# Altium schematic sheet EDU_High-Speed-Design_CPU_Unused.SchDoc: CPU Unused
size 431 x 279 mm; Date: not used; ApprovedBy: not used; CheckedBy: not used; Author: not used; DrawnBy: not used; Organization: not used; Address4: not used; SheetNumber: 27; SheetTotal: 27; Time: not used; ImagePath: not used; Application_BuildNumber: not used
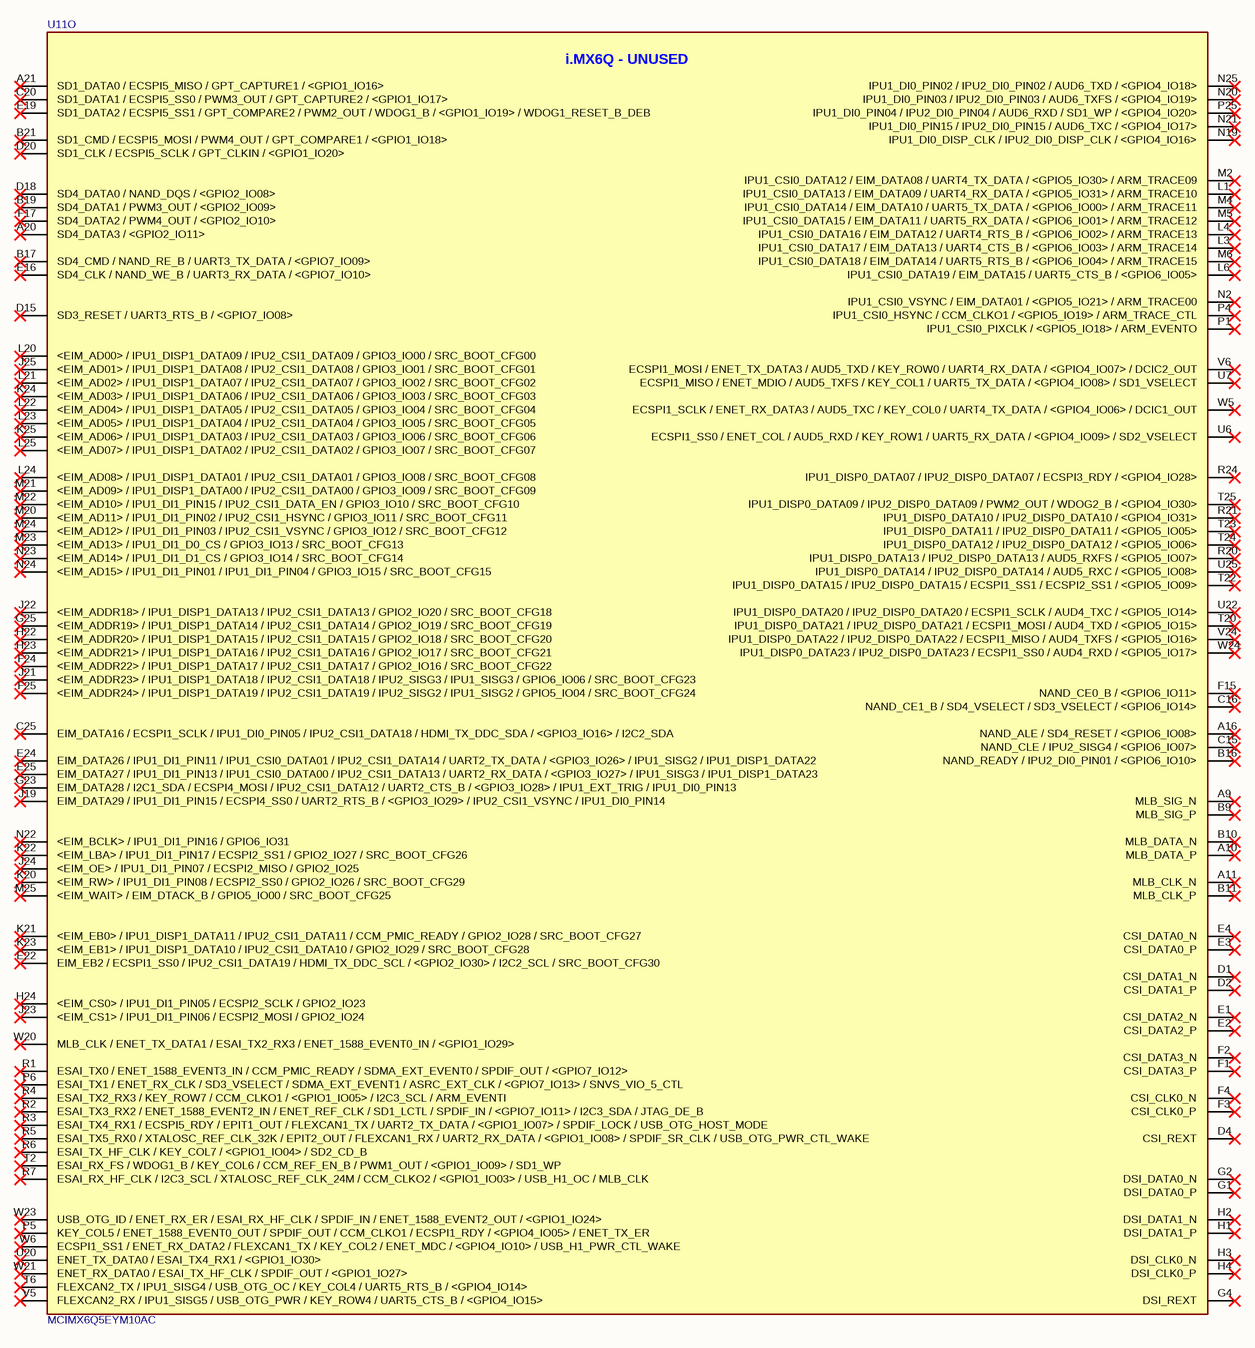
[diagram p0: EDU_High-Speed-Design_CPU_Unused.SchDoc]

## Parts
U11  MCIMX6Q5EYM10AC  [MCIMX6Q5EYM10AC]  (part O of 15)

## Nets

Not connected (* = marked no-connect by the designer): U11 A9(MLB_SIG_N)* A10(MLB_DATA_P)* A11(MLB_CLK_N)* A16(NAND_ALE_/_SD4_RESET_/_<GPIO6_IO08>)* A20(SD4_DATA3_/_<GPIO2_IO11>)* A21(SD1_DATA0_/_ECSPI5_MISO_/_GPT_CAPTURE1_/_<GPIO1_IO16>)* B9(MLB_SIG_P)* B10(MLB_DATA_N)* B11(MLB_CLK_P)* B16(NAND_READY_/_IPU2_DI0_PIN01_/_<GPIO6_IO10>)* B17(SD4_CMD_/_NAND_RE_B_/_UART3_TX_DATA_/_<GPIO7_IO09>)* B19(SD4_DATA1_/_PWM3_OUT_/_<GPIO2_IO09>)* B21(SD1_CMD_/_ECSPI5_MOSI_/_PWM4_OUT_/_GPT_COMPARE1_/_<GPIO1_IO18>)* C15(NAND_CLE_/_IPU2_SISG4_/_<GPIO6_IO07>)* C16(NAND_CE1_B_/_SD4_VSELECT_/_SD3_VSELECT_/_<GPIO6_IO14>)* C20(SD1_DATA1_/_ECSPI5_SS0_/_PWM3_OUT_/_GPT_CAPTURE2_/_<GPIO1_IO17>)* C25(EIM_DATA16_/_ECSPI1_SCLK_/_IPU1_DI0_PIN05_/_IPU2_CSI1_DATA18_/_HDMI_TX_DDC_SDA_/_<GPIO3_IO16>_/_I2C2_SDA)* D1(CSI_DATA1_N)* D2(CSI_DATA1_P)* D4(CSI_REXT)* D15(SD3_RESET_/_UART3_RTS_B_/_<GPIO7_IO08>)* D18(SD4_DATA0_/_NAND_DQS_/_<GPIO2_IO08>)* D20(SD1_CLK_/_ECSPI5_SCLK_/_GPT_CLKIN_/_<GPIO1_IO20>)* E1(CSI_DATA2_N)* E2(CSI_DATA2_P)* E3(CSI_DATA0_P)* E4(CSI_DATA0_N)* E16(SD4_CLK_/_NAND_WE_B_/_UART3_RX_DATA_/_<GPIO7_IO10>)* E19(SD1_DATA2_/_ECSPI5_SS1_/_GPT_COMPARE2_/_PWM2_OUT_/_WDOG1_B_/_<GPIO1_IO19>_/_WDOG1_RESET_B_DEB)* E22(EIM_EB2_/_ECSPI1_SS0_/_IPU2_CSI1_DATA19_/_HDMI_TX_DDC_SCL_/_<GPIO2_IO30>_/_I2C2_SCL_/_SRC_BOOT_CFG30)* E24(EIM_DATA26_/_IPU1_DI1_PIN11_/_IPU1_CSI0_DATA01_/_IPU2_CSI1_DATA14_/_UART2_TX_DATA_/_<GPIO3_IO26>_/_IPU1_SISG2_/_IPU1_DISP1_DATA22)* E25(EIM_DATA27_/_IPU1_DI1_PIN13_/_IPU1_CSI0_DATA00_/_IPU2_CSI1_DATA13_/_UART2_RX_DATA_/_<GPIO3_IO27>_/_IPU1_SISG3_/_IPU1_DISP1_DATA23)* F1(CSI_DATA3_P)* F2(CSI_DATA3_N)* F3(CSI_CLK0_P)* F4(CSI_CLK0_N)* F15(NAND_CE0_B_/_<GPIO6_IO11>)* F17(SD4_DATA2_/_PWM4_OUT_/_<GPIO2_IO10>)* F24(<EIM_ADDR22>_/_IPU1_DISP1_DATA17_/_IPU2_CSI1_DATA17_/_GPIO2_IO16_/_SRC_BOOT_CFG22)* F25(<EIM_ADDR24>_/_IPU1_DISP1_DATA19_/_IPU2_CSI1_DATA19_/_IPU2_SISG2_/_IPU1_SISG2_/_GPIO5_IO04_/_SRC_BOOT_CFG24)* G1(DSI_DATA0_P)* G2(DSI_DATA0_N)* G4(DSI_REXT)* G23(EIM_DATA28_/_I2C1_SDA_/_ECSPI4_MOSI_/_IPU2_CSI1_DATA12_/_UART2_CTS_B_/_<GPIO3_IO28>_/_IPU1_EXT_TRIG_/_IPU1_DI0_PIN13)* G25(<EIM_ADDR19>_/_IPU1_DISP1_DATA14_/_IPU2_CSI1_DATA14_/_GPIO2_IO19_/_SRC_BOOT_CFG19)* H1(DSI_DATA1_P)* H2(DSI_DATA1_N)* H3(DSI_CLK0_N)* H4(DSI_CLK0_P)* H22(<EIM_ADDR20>_/_IPU1_DISP1_DATA15_/_IPU2_CSI1_DATA15_/_GPIO2_IO18_/_SRC_BOOT_CFG20)* H23(<EIM_ADDR21>_/_IPU1_DISP1_DATA16_/_IPU2_CSI1_DATA16_/_GPIO2_IO17_/_SRC_BOOT_CFG21)* H24(<EIM_CS0>_/_IPU1_DI1_PIN05_/_ECSPI2_SCLK_/_GPIO2_IO23)* J19(EIM_DATA29_/_IPU1_DI1_PIN15_/_ECSPI4_SS0_/_UART2_RTS_B_/_<GPIO3_IO29>_/_IPU2_CSI1_VSYNC_/_IPU1_DI0_PIN14)* J21(<EIM_ADDR23>_/_IPU1_DISP1_DATA18_/_IPU2_CSI1_DATA18_/_IPU2_SISG3_/_IPU1_SISG3_/_GPIO6_IO06_/_SRC_BOOT_CFG23)* J22(<EIM_ADDR18>_/_IPU1_DISP1_DATA13_/_IPU2_CSI1_DATA13_/_GPIO2_IO20_/_SRC_BOOT_CFG18)* J23(<EIM_CS1>_/_IPU1_DI1_PIN06_/_ECSPI2_MOSI_/_GPIO2_IO24)* J24(<EIM_OE>_/_IPU1_DI1_PIN07_/_ECSPI2_MISO_/_GPIO2_IO25)* J25(<EIM_AD01>_/_IPU1_DISP1_DATA08_/_IPU2_CSI1_DATA08_/_GPIO3_IO01_/_SRC_BOOT_CFG01)* K20(<EIM_RW>_/_IPU1_DI1_PIN08_/_ECSPI2_SS0_/_GPIO2_IO26_/_SRC_BOOT_CFG29)* K21(<EIM_EB0>_/_IPU1_DISP1_DATA11_/_IPU2_CSI1_DATA11_/_CCM_PMIC_READY_/_GPIO2_IO28_/_SRC_BOOT_CFG27)* K22(<EIM_LBA>_/_IPU1_DI1_PIN17_/_ECSPI2_SS1_/_GPIO2_IO27_/_SRC_BOOT_CFG26)* K23(<EIM_EB1>_/_IPU1_DISP1_DATA10_/_IPU2_CSI1_DATA10_/_GPIO2_IO29_/_SRC_BOOT_CFG28)* K24(<EIM_AD03>_/_IPU1_DISP1_DATA06_/_IPU2_CSI1_DATA06_/_GPIO3_IO03_/_SRC_BOOT_CFG03)* K25(<EIM_AD06>_/_IPU1_DISP1_DATA03_/_IPU2_CSI1_DATA03_/_GPIO3_IO06_/_SRC_BOOT_CFG06)* L1(IPU1_CSI0_DATA13_/_EIM_DATA09_/_UART4_RX_DATA_/_<GPIO5_IO31>_/_ARM_TRACE10)* L3(IPU1_CSI0_DATA17_/_EIM_DATA13_/_UART4_CTS_B_/_<GPIO6_IO03>_/_ARM_TRACE14)* L4(IPU1_CSI0_DATA16_/_EIM_DATA12_/_UART4_RTS_B_/_<GPIO6_IO02>_/_ARM_TRACE13)* L6(IPU1_CSI0_DATA19_/_EIM_DATA15_/_UART5_CTS_B_/_<GPIO6_IO05>)* L20(<EIM_AD00>_/_IPU1_DISP1_DATA09_/_IPU2_CSI1_DATA09_/_GPIO3_IO00_/_SRC_BOOT_CFG00)* L21(<EIM_AD02>_/_IPU1_DISP1_DATA07_/_IPU2_CSI1_DATA07_/_GPIO3_IO02_/_SRC_BOOT_CFG02)* L22(<EIM_AD04>_/_IPU1_DISP1_DATA05_/_IPU2_CSI1_DATA05_/_GPIO3_IO04_/_SRC_BOOT_CFG04)* L23(<EIM_AD05>_/_IPU1_DISP1_DATA04_/_IPU2_CSI1_DATA04_/_GPIO3_IO05_/_SRC_BOOT_CFG05)* L24(<EIM_AD08>_/_IPU1_DISP1_DATA01_/_IPU2_CSI1_DATA01_/_GPIO3_IO08_/_SRC_BOOT_CFG08)* L25(<EIM_AD07>_/_IPU1_DISP1_DATA02_/_IPU2_CSI1_DATA02_/_GPIO3_IO07_/_SRC_BOOT_CFG07)* M2(IPU1_CSI0_DATA12_/_EIM_DATA08_/_UART4_TX_DATA_/_<GPIO5_IO30>_/_ARM_TRACE09)* M4(IPU1_CSI0_DATA14_/_EIM_DATA10_/_UART5_TX_DATA_/_<GPIO6_IO00>_/_ARM_TRACE11)* M5(IPU1_CSI0_DATA15_/_EIM_DATA11_/_UART5_RX_DATA_/_<GPIO6_IO01>_/_ARM_TRACE12)* M6(IPU1_CSI0_DATA18_/_EIM_DATA14_/_UART5_RTS_B_/_<GPIO6_IO04>_/_ARM_TRACE15)* M20(<EIM_AD11>_/_IPU1_DI1_PIN02_/_IPU2_CSI1_HSYNC_/_GPIO3_IO11_/_SRC_BOOT_CFG11)* M21(<EIM_AD09>_/_IPU1_DISP1_DATA00_/_IPU2_CSI1_DATA00_/_GPIO3_IO09_/_SRC_BOOT_CFG09)* M22(<EIM_AD10>_/_IPU1_DI1_PIN15_/_IPU2_CSI1_DATA_EN_/_GPIO3_IO10_/_SRC_BOOT_CFG10)* M23(<EIM_AD13>_/_IPU1_DI1_D0_CS_/_GPIO3_IO13_/_SRC_BOOT_CFG13)* M24(<EIM_AD12>_/_IPU1_DI1_PIN03_/_IPU2_CSI1_VSYNC_/_GPIO3_IO12_/_SRC_BOOT_CFG12)* M25(<EIM_WAIT>_/_EIM_DTACK_B_/_GPIO5_IO00_/_SRC_BOOT_CFG25)* N2(IPU1_CSI0_VSYNC_/_EIM_DATA01_/_<GPIO5_IO21>_/_ARM_TRACE00)* N19(IPU1_DI0_DISP_CLK_/_IPU2_DI0_DISP_CLK_/_<GPIO4_IO16>)* N20(IPU1_DI0_PIN03_/_IPU2_DI0_PIN03_/_AUD6_TXFS_/_<GPIO4_IO19>)* N21(IPU1_DI0_PIN15_/_IPU2_DI0_PIN15_/_AUD6_TXC_/_<GPIO4_IO17>)* N22(<EIM_BCLK>_/_IPU1_DI1_PIN16_/_GPIO6_IO31)* N23(<EIM_AD14>_/_IPU1_DI1_D1_CS_/_GPIO3_IO14_/_SRC_BOOT_CFG14)* N24(<EIM_AD15>_/_IPU1_DI1_PIN01_/_IPU1_DI1_PIN04_/_GPIO3_IO15_/_SRC_BOOT_CFG15)* N25(IPU1_DI0_PIN02_/_IPU2_DI0_PIN02_/_AUD6_TXD_/_<GPIO4_IO18>)* P1(IPU1_CSI0_PIXCLK_/_<GPIO5_IO18>_/_ARM_EVENTO)* P4(IPU1_CSI0_HSYNC_/_CCM_CLKO1_/_<GPIO5_IO19>_/_ARM_TRACE_CTL)* P5(KEY_COL5_/_ENET_1588_EVENT0_OUT_/_SPDIF_OUT_/_CCM_CLKO1_/_ECSPI1_RDY_/_<GPIO4_IO05>_/_ENET_TX_ER)* P6(ESAI_TX1_/_ENET_RX_CLK_/_SD3_VSELECT_/_SDMA_EXT_EVENT1_/_ASRC_EXT_CLK_/_<GPIO7_IO13>_/_SNVS_VIO_5_CTL)* P25(IPU1_DI0_PIN04_/_IPU2_DI0_PIN04_/_AUD6_RXD_/_SD1_WP_/_<GPIO4_IO20>)* R1(ESAI_TX0_/_ENET_1588_EVENT3_IN_/_CCM_PMIC_READY_/_SDMA_EXT_EVENT0_/_SPDIF_OUT_/_<GPIO7_IO12>)* R2(ESAI_TX3_RX2_/_ENET_1588_EVENT2_IN_/_ENET_REF_CLK_/_SD1_LCTL_/_SPDIF_IN_/_<GPIO7_IO11>_/_I2C3_SDA_/_JTAG_DE_B)* R3(ESAI_TX4_RX1_/_ECSPI5_RDY_/_EPIT1_OUT_/_FLEXCAN1_TX_/_UART2_TX_DATA_/_<GPIO1_IO07>_/_SPDIF_LOCK_/_USB_OTG_HOST_MODE)* R4(ESAI_TX2_RX3_/_KEY_ROW7_/_CCM_CLKO1_/_<GPIO1_IO05>_/_I2C3_SCL_/_ARM_EVENTI)* R5(ESAI_TX5_RX0_/_XTALOSC_REF_CLK_32K_/_EPIT2_OUT_/_FLEXCAN1_RX_/_UART2_RX_DATA_/_<GPIO1_IO08>_/_SPDIF_SR_CLK_/_USB_OTG_PWR_CTL_WAKE)* R6(ESAI_TX_HF_CLK_/_KEY_COL7_/_<GPIO1_IO04>_/_SD2_CD_B)* R7(ESAI_RX_HF_CLK_/_I2C3_SCL_/_XTALOSC_REF_CLK_24M_/_CCM_CLKO2_/_<GPIO1_IO03>_/_USB_H1_OC_/_MLB_CLK)* R20(IPU1_DISP0_DATA13_/_IPU2_DISP0_DATA13_/_AUD5_RXFS_/_<GPIO5_IO07>)* R21(IPU1_DISP0_DATA10_/_IPU2_DISP0_DATA10_/_<GPIO4_IO31>)* R24(IPU1_DISP0_DATA07_/_IPU2_DISP0_DATA07_/_ECSPI3_RDY_/_<GPIO4_IO28>)* T2(ESAI_RX_FS_/_WDOG1_B_/_KEY_COL6_/_CCM_REF_EN_B_/_PWM1_OUT_/_<GPIO1_IO09>_/_SD1_WP)* T6(FLEXCAN2_TX_/_IPU1_SISG4_/_USB_OTG_OC_/_KEY_COL4_/_UART5_RTS_B_/_<GPIO4_IO14>)* T20(IPU1_DISP0_DATA21_/_IPU2_DISP0_DATA21_/_ECSPI1_MOSI_/_AUD4_TXD_/_<GPIO5_IO15>)* T22(IPU1_DISP0_DATA15_/_IPU2_DISP0_DATA15_/_ECSPI1_SS1_/_ECSPI2_SS1_/_<GPIO5_IO09>)* T23(IPU1_DISP0_DATA11_/_IPU2_DISP0_DATA11_/_<GPIO5_IO05>)* T24(IPU1_DISP0_DATA12_/_IPU2_DISP0_DATA12_/_<GPIO5_IO06>)* T25(IPU1_DISP0_DATA09_/_IPU2_DISP0_DATA09_/_PWM2_OUT_/_WDOG2_B_/_<GPIO4_IO30>)* U6(ECSPI1_SS0_/_ENET_COL_/_AUD5_RXD_/_KEY_ROW1_/_UART5_RX_DATA_/_<GPIO4_IO09>_/_SD2_VSELECT)* U7(ECSPI1_MISO_/_ENET_MDIO_/_AUD5_TXFS_/_KEY_COL1_/_UART5_TX_DATA_/_<GPIO4_IO08>_/_SD1_VSELECT)* U20(ENET_TX_DATA0_/_ESAI_TX4_RX1_/_<GPIO1_IO30>)* U22(IPU1_DISP0_DATA20_/_IPU2_DISP0_DATA20_/_ECSPI1_SCLK_/_AUD4_TXC_/_<GPIO5_IO14>)* U25(IPU1_DISP0_DATA14_/_IPU2_DISP0_DATA14_/_AUD5_RXC_/_<GPIO5_IO08>)* V5(FLEXCAN2_RX_/_IPU1_SISG5_/_USB_OTG_PWR_/_KEY_ROW4_/_UART5_CTS_B_/_<GPIO4_IO15>)* V6(ECSPI1_MOSI_/_ENET_TX_DATA3_/_AUD5_TXD_/_KEY_ROW0_/_UART4_RX_DATA_/_<GPIO4_IO07>_/_DCIC2_OUT)* V24(IPU1_DISP0_DATA22_/_IPU2_DISP0_DATA22_/_ECSPI1_MISO_/_AUD4_TXFS_/_<GPIO5_IO16>)* W5(ECSPI1_SCLK_/_ENET_RX_DATA3_/_AUD5_TXC_/_KEY_COL0_/_UART4_TX_DATA_/_<GPIO4_IO06>_/_DCIC1_OUT)* W6(ECSPI1_SS1_/_ENET_RX_DATA2_/_FLEXCAN1_TX_/_KEY_COL2_/_ENET_MDC_/_<GPIO4_IO10>_/_USB_H1_PWR_CTL_WAKE)* W20(MLB_CLK_/_ENET_TX_DATA1_/_ESAI_TX2_RX3_/_ENET_1588_EVENT0_IN_/_<GPIO1_IO29>)* W21(ENET_RX_DATA0_/_ESAI_TX_HF_CLK_/_SPDIF_OUT_/_<GPIO1_IO27>)* W23(USB_OTG_ID_/_ENET_RX_ER_/_ESAI_RX_HF_CLK_/_SPDIF_IN_/_ENET_1588_EVENT2_OUT_/_<GPIO1_IO24>)* W24(IPU1_DISP0_DATA23_/_IPU2_DISP0_DATA23_/_ECSPI1_SS0_/_AUD4_RXD_/_<GPIO5_IO17>)*

## Notes on the sheet
- Title:
- Date:
- Size B
- Project:
- Time:
- Sheet
- Revision
- of
- Engineer:
- File:
- (in symbol MCIMX6Q5EYM10AC, part O) i.MX6Q - UNUSED

## Library data of the parts
U11 = MCIMX6Q5EYM10AC: IC MCU 32BIT ARM QUAD 624FCBGA; Manufacturer 1: Freescale Semiconductor; Supplier 1: Digi-Key; Manufacturer Part Number 1: MCIMX6Q5EYM10AC; Supplier Part Number 1: MCIMX6Q5EYM10AC-ND